# EAGLE design qPCR_pcb_breakout_TLC59281DBQR (EAGLE 9.6.1)
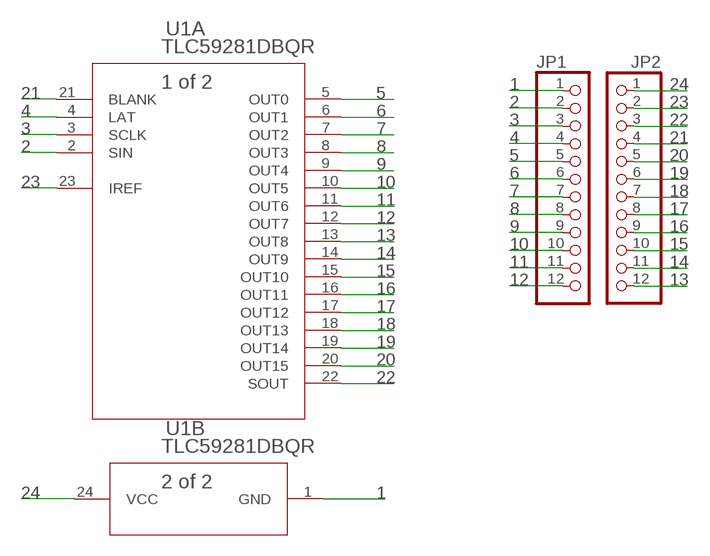
[diagram p0: schematic, sheet 1]

## Parts
JP1  PINHD-1X12  [1X12]
JP2  PINHD-1X12  [1X12]
U1  TLC59281DBQR  [DBQ24]

## Nets
1: JP1.1 U1.1(B:GND)
2: JP1.2 U1.2(A:SIN)
3: JP1.3 U1.3(A:SCLK)
4: JP1.4 U1.4(A:LAT)
5: JP1.5 U1.5(A:OUT0)
6: JP1.6 U1.6(A:OUT1)
7: JP1.7 U1.7(A:OUT2)
8: JP1.8 U1.8(A:OUT3)
9: JP1.9 U1.9(A:OUT4)
10: JP1.10 U1.10(A:OUT5)
11: JP1.11 U1.11(A:OUT6)
12: JP1.12 U1.12(A:OUT7)
13: JP2.12 U1.13(A:OUT8)
14: JP2.11 U1.14(A:OUT9)
15: JP2.10 U1.15(A:OUT10)
16: JP2.9 U1.16(A:OUT11)
17: JP2.8 U1.17(A:OUT12)
18: JP2.7 U1.18(A:OUT13)
19: JP2.6 U1.19(A:OUT14)
20: JP2.5 U1.20(A:OUT15)
21: JP2.4 U1.21(A:BLANK)
22: JP2.3 U1.22(A:SOUT)
23: JP2.2 U1.23(A:IREF)
24: JP2.1 U1.24(B:VCC)

## Library data of the parts
JP1 JP2 = pinhead:PINHD-1X12: PIN HEADER
U1 = Ninja_qPCR:TLC59281DBQR; BUILT_BY: EMA_UL_Team; MANUFACTURER: Texas Instruments; MANUFACTURER_PART_NUMBER: TLC59281DBQR; SOURCELIBRARY: TI_2014-06-19; VENDOR: Texas Instruments

## Board
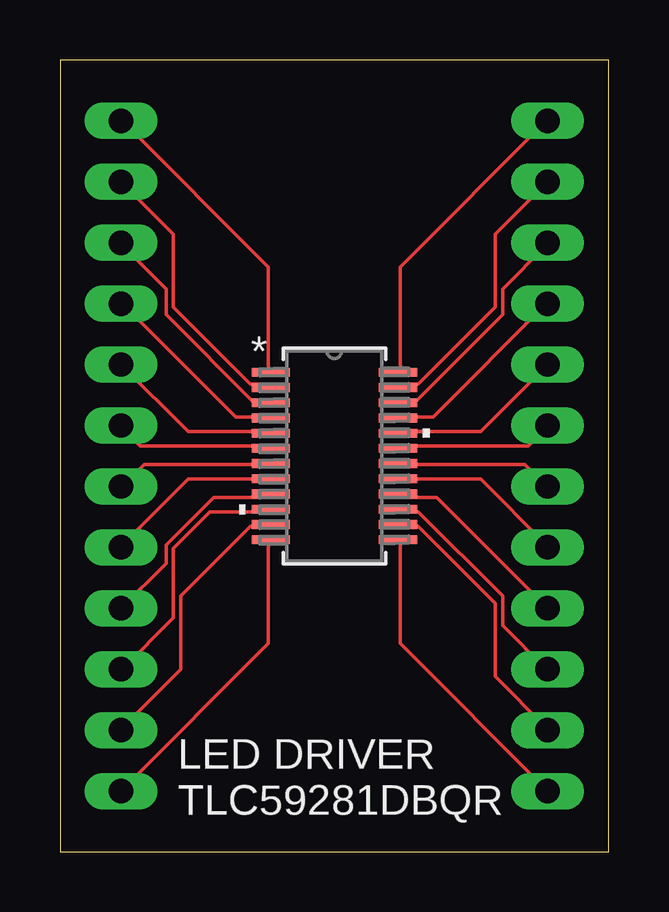
[diagram p1: board, top side]
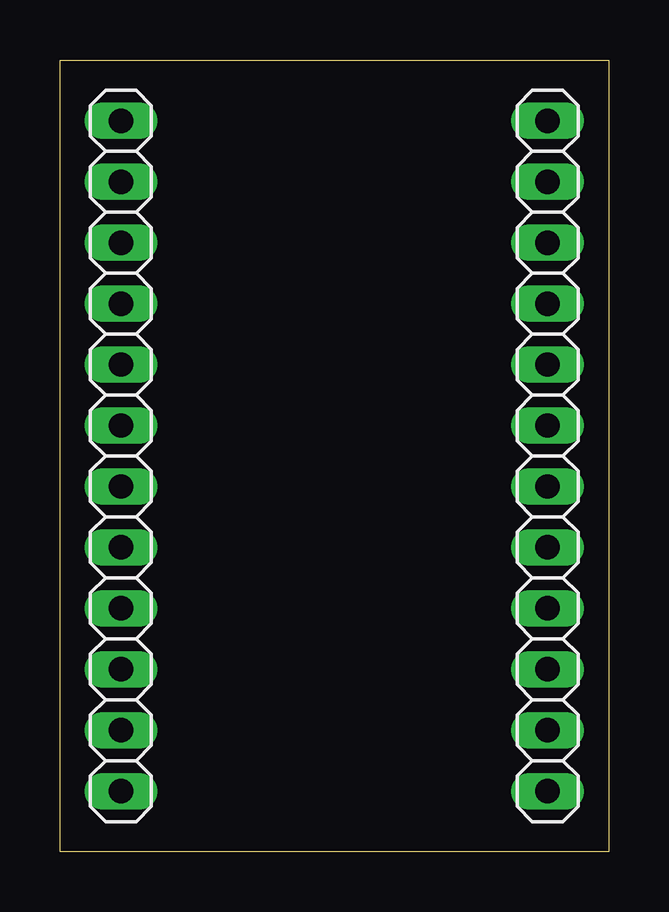
[diagram p2: board, bottom side, seen from below]

Size 22.86 x 33.02 mm. Coordinates in mm from the lower left corner, seen from the top.
Outline: 0,0 22.86,0 22.86,33.02 0,33.02 0,0
Copper layers (1*16): Top 0.035mm / dielectric 1.5mm / Bottom 0.035mm
Design rules "default": minimum track width 6mil, minimum drill 0.35mm, track to track 6mil, track to pad 6mil, pad to pad 6mil, via to via 6mil, smd to smd 6mil, copper to edge 40mil, drill to drill 6mil, minimum pad ring 10mil, minimum via ring 8mil, stop-mask expansion 4mil, vias tented up to drill 0mil, thermal gap 10mil

### Footprints (pad centres in the part's own frame; a part is rotated, then mirrored left to right if it is on the bottom)
1X12 = drill 1.016 long: 1 -13.97,0; 2 -11.43,0; 3 -8.89,0; 4 -6.35,0; 5 -3.81,0; 6 -1.27,0; 7 1.27,0; 8 3.81,0; 9 6.35,0; 10 8.89,0; 11 11.43,0; 12 13.97,0
DBQ24 = smd 1.589 x 0.365: 1 -2.654,3.493; 2 -2.654,2.857; 3 -2.654,2.223; 4 -2.654,1.587; 5 -2.654,0.953; 6 -2.654,0.318; 7 -2.654,-0.318; 8 -2.654,-0.953; 9 -2.654,-1.587; 10 -2.654,-2.223; 11 -2.654,-2.857; 12 -2.654,-3.493; 13 2.654,-3.493; 14 2.654,-2.857; 15 2.654,-2.223; 16 2.654,-1.587; 17 2.654,-0.953; 18 2.654,-0.318; 19 2.654,0.318; 20 2.654,0.953; 21 2.654,1.587; 22 2.654,2.223; 23 2.654,2.857; 24 2.654,3.493

### Placement (x,y rotation side)
JP1  2.54,16.51 270 bottom
JP2  20.32,16.51 270 bottom
U1  11.43,16.51 0 top

### Tracks (layer width: path | path; a pad name or v marks a point on that pad's centre or on a via)
1
  Top 0.152: U1.1 8.69,20.12 8.69,24.38 2.59,30.48 JP1.1
2
  Top 0.152: JP1.2 4.72,25.76 4.72,22.71 7.92,19.51 8.69,19.51 U1.2
3
  Top 0.152: U1.3 8.69,18.75 8.08,18.75 4.42,22.4 4.42,23.47 2.59,25.3 JP1.3
4
  Top 0.152: U1.4 8.69,18.14 7.32,18.14 2.59,22.86 JP1.4
5
  Top 0.152: JP1.5 5.33,17.53 8.69,17.53 U1.5
6
  Top 0.152: U1.6 8.69,16.92 3.35,16.92 2.59,17.68 JP1.6
7
  Top 0.152: U1.7 8.69,16.15 3.5,16.15 2.59,15.24 JP1.7
8
  Top 0.152: U1.8 8.69,15.54 5.33,15.54 2.59,12.8 JP1.8
9
  Top 0.152: JP1.9 4.42,12.04 4.42,12.8 6.4,14.78 8.69,14.78 U1.9
10
  Top 0.152: U1.10 8.69,14.17 6.25,14.17 4.72,12.65 4.72,9.75 2.59,7.62 JP1.10
11
  Top 0.152: U1.11 8.69,13.56 7.92,13.56 5.03,10.67 5.03,7.62 2.59,5.18 JP1.11
12
  Top 0.152: JP1.12 8.69,8.69 8.69,12.95 U1.12
13
  Top 0.152: JP2.12 14.17,8.69 14.17,12.95 U1.13
14
  Top 0.152: U1.14 14.17,13.56 14.94,13.56 18.14,10.36 18.14,7.32 20.27,5.18 JP2.11
15
  Top 0.152: U1.15 14.17,14.17 14.94,14.17 18.44,10.67 18.44,9.45 20.27,7.62 JP2.10
16
  Top 0.152: JP2.9 15.7,14.78 14.17,14.78 U1.16
17
  Top 0.152: U1.17 14.17,15.54 17.53,15.54 20.27,12.8 JP2.8
18
  Top 0.152: U1.18 14.17,16.15 19.36,16.15 20.27,15.24 JP2.7
19
  Top 0.152: U1.19 14.17,16.92 19.51,16.92 20.27,17.68 JP2.6
20
  Top 0.152: JP2.5 17.53,17.53 14.17,17.53 U1.20
21
  Top 0.152: U1.21 14.17,18.14 15.54,18.14 20.27,22.86 JP2.4
22
  Top 0.152: U1.22 14.17,18.75 14.78,18.75 18.44,22.4 18.44,23.47 20.27,25.3 JP2.3
23
  Top 0.152: JP2.2 18.14,25.76 18.14,22.71 14.94,19.51 14.17,19.51 U1.23
24
  Top 0.152: U1.24 14.17,20.12 14.17,24.38 20.27,30.48 JP2.1

### Text on the board
tPlace: LED DRIVER / TLC59281DBQR